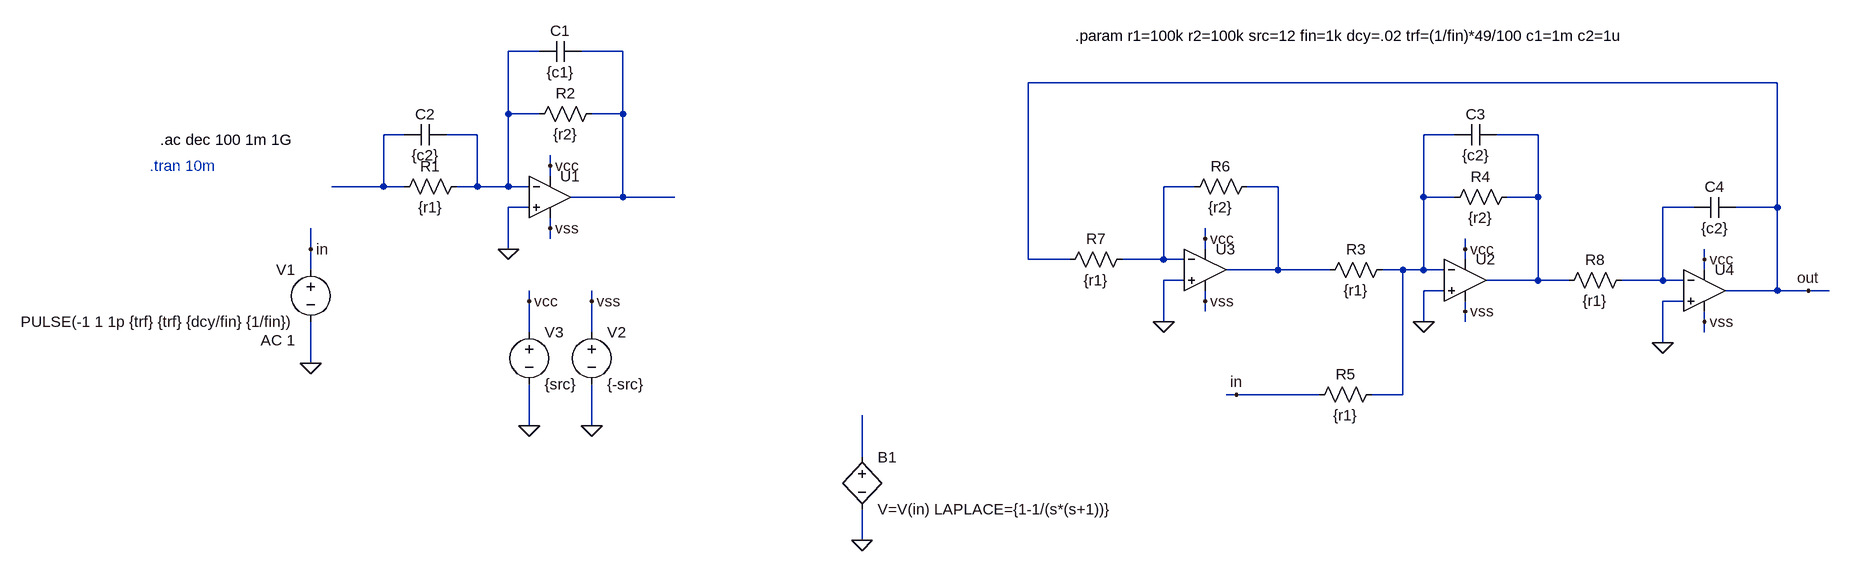
[diagram p0: schematic Draft1.asc]
Draft1.asc, the LTspice schematic file:
Version 4
SHEET 1 1684 680
WIRE -304 -496 -352 -496
WIRE -176 -496 -240 -496
WIRE 1600 -448 448 -448
WIRE -352 -400 -352 -496
WIRE -304 -400 -352 -400
WIRE -176 -400 -176 -496
WIRE -176 -400 -224 -400
WIRE -512 -368 -544 -368
WIRE -400 -368 -448 -368
WIRE 1104 -368 1056 -368
WIRE 1232 -368 1168 -368
WIRE -288 -320 -288 -336
WIRE -288 -304 -288 -320
WIRE -544 -288 -544 -368
WIRE -544 -288 -624 -288
WIRE -512 -288 -544 -288
WIRE -400 -288 -400 -368
WIRE -400 -288 -432 -288
WIRE -352 -288 -352 -400
WIRE -352 -288 -400 -288
WIRE -320 -288 -352 -288
WIRE 704 -288 656 -288
WIRE 832 -288 784 -288
WIRE -176 -272 -176 -400
WIRE -176 -272 -256 -272
WIRE -96 -272 -176 -272
WIRE 1056 -272 1056 -368
WIRE 1104 -272 1056 -272
WIRE 1232 -272 1232 -368
WIRE 1232 -272 1184 -272
WIRE -320 -256 -352 -256
WIRE 1472 -256 1424 -256
WIRE 1600 -256 1600 -448
WIRE 1600 -256 1536 -256
WIRE -288 -224 -288 -240
WIRE -288 -208 -288 -224
WIRE 720 -208 720 -224
WIRE -656 -192 -656 -224
WIRE -352 -192 -352 -256
WIRE 720 -192 720 -208
WIRE 1120 -192 1120 -208
WIRE 448 -176 448 -448
WIRE 512 -176 448 -176
WIRE 656 -176 656 -288
WIRE 656 -176 592 -176
WIRE 688 -176 656 -176
WIRE 1120 -176 1120 -192
WIRE 1488 -176 1488 -192
WIRE -656 -160 -656 -192
WIRE 832 -160 832 -288
WIRE 832 -160 752 -160
WIRE 912 -160 832 -160
WIRE 1024 -160 992 -160
WIRE 1056 -160 1056 -272
WIRE 1056 -160 1024 -160
WIRE 1088 -160 1056 -160
WIRE 1488 -160 1488 -176
WIRE 688 -144 656 -144
WIRE 1232 -144 1232 -272
WIRE 1232 -144 1152 -144
WIRE 1280 -144 1232 -144
WIRE 1424 -144 1424 -256
WIRE 1424 -144 1360 -144
WIRE 1456 -144 1424 -144
WIRE 1088 -128 1056 -128
WIRE 1600 -128 1600 -256
WIRE 1600 -128 1520 -128
WIRE 1648 -128 1600 -128
WIRE 1680 -128 1648 -128
WIRE -320 -112 -320 -128
WIRE -224 -112 -224 -128
WIRE 720 -112 720 -128
WIRE 1456 -112 1424 -112
WIRE 720 -96 720 -112
WIRE 1120 -96 1120 -112
WIRE 656 -80 656 -144
WIRE 1056 -80 1056 -128
WIRE 1120 -80 1120 -96
WIRE 1488 -80 1488 -96
WIRE -320 -64 -320 -112
WIRE -224 -64 -224 -112
WIRE 1488 -64 1488 -80
WIRE 1424 -48 1424 -112
WIRE -656 -16 -656 -80
WIRE 768 32 752 32
WIRE 896 32 768 32
WIRE 1024 32 1024 -160
WIRE 1024 32 976 32
WIRE -320 80 -320 16
WIRE -224 80 -224 16
WIRE 192 128 192 64
WIRE 192 256 192 208
FLAG -288 -320 vcc
FLAG -288 -224 vss
FLAG -656 -16 0
FLAG -224 80 0
FLAG -320 80 0
FLAG -320 -112 vcc
FLAG -224 -112 vss
FLAG -352 -192 0
FLAG -656 -192 in
FLAG 192 256 0
FLAG 1120 -192 vcc
FLAG 1120 -96 vss
FLAG 768 32 in
FLAG 720 -208 vcc
FLAG 720 -112 vss
FLAG 656 -80 0
FLAG 1488 -176 vcc
FLAG 1488 -80 vss
FLAG 1424 -48 0
FLAG 1648 -128 out
FLAG 1056 -80 0
SYMBOL OpAmps\\UniversalOpamp -288 -272 R0
SYMATTR InstName U1
SYMBOL res -416 -304 R90
WINDOW 0 0 56 VBottom 2
WINDOW 3 32 56 VTop 2
SYMATTR InstName R1
SYMATTR Value {r1}
SYMBOL res -208 -416 R90
WINDOW 0 0 56 VBottom 2
WINDOW 3 32 56 VTop 2
SYMATTR InstName R2
SYMATTR Value {r2}
SYMBOL voltage -656 -176 M0
WINDOW 123 24 124 Left 2
WINDOW 39 0 0 Left 0
SYMATTR Value2 AC 1
SYMATTR InstName V1
SYMATTR Value PULSE(-1 1 1p {trf} {trf} {dcy/fin} {1/fin})
SYMBOL voltage -224 -80 R0
WINDOW 123 0 0 Left 0
WINDOW 39 0 0 Left 0
SYMATTR InstName V2
SYMATTR Value {-src}
SYMBOL voltage -320 -80 R0
WINDOW 123 0 0 Left 0
WINDOW 39 0 0 Left 0
SYMATTR InstName V3
SYMATTR Value {src}
SYMBOL cap -240 -512 R90
WINDOW 0 0 32 VBottom 2
WINDOW 3 32 32 VTop 2
SYMATTR InstName C1
SYMATTR Value {c1}
SYMBOL cap -448 -384 R90
WINDOW 0 0 32 VBottom 2
WINDOW 3 32 32 VTop 2
SYMATTR InstName C2
SYMATTR Value {c2}
SYMBOL bv 192 112 R0
SYMATTR InstName B1
SYMATTR Value V=V(in) LAPLACE={1-1/(s*(s+1))}
SYMBOL cap 1168 -384 R90
WINDOW 0 0 32 VBottom 2
WINDOW 3 32 32 VTop 2
SYMATTR InstName C3
SYMATTR Value {c2}
SYMBOL OpAmps\\UniversalOpamp 1120 -144 R0
SYMATTR InstName U2
SYMBOL res 1008 -176 R90
WINDOW 0 0 56 VBottom 2
WINDOW 3 32 56 VTop 2
SYMATTR InstName R3
SYMATTR Value {r1}
SYMBOL res 1200 -288 R90
WINDOW 0 0 56 VBottom 2
WINDOW 3 32 56 VTop 2
SYMATTR InstName R4
SYMATTR Value {r2}
SYMBOL res 880 48 R270
WINDOW 0 32 56 VTop 2
WINDOW 3 0 56 VBottom 2
SYMATTR InstName R5
SYMATTR Value {r1}
SYMBOL OpAmps\\UniversalOpamp 720 -160 R0
SYMATTR InstName U3
SYMBOL res 800 -304 R90
WINDOW 0 0 56 VBottom 2
WINDOW 3 32 56 VTop 2
SYMATTR InstName R6
SYMATTR Value {r2}
SYMBOL res 608 -192 R90
WINDOW 0 0 56 VBottom 2
WINDOW 3 32 56 VTop 2
SYMATTR InstName R7
SYMATTR Value {r1}
SYMBOL OpAmps\\UniversalOpamp 1488 -128 R0
SYMATTR InstName U4
SYMBOL res 1376 -160 R90
WINDOW 0 0 56 VBottom 2
WINDOW 3 32 56 VTop 2
SYMATTR InstName R8
SYMATTR Value {r1}
SYMBOL cap 1536 -272 R90
WINDOW 0 0 32 VBottom 2
WINDOW 3 32 32 VTop 2
SYMATTR InstName C4
SYMATTR Value {c2}
TEXT -888 -360 Left 2 !.ac dec 100 1m 1G
TEXT 520 -520 Left 2 !.param r1=100k r2=100k src=12 fin=1k dcy=.02 trf=(1/fin)*49/100 c1=1m c2=1u
TEXT -904 -320 Left 2 ;.tran 10m

The netlist it stands for:
* Draft1.asc
XU1 0 N001 vcc vss N002 level1 Avol=1Meg GBW=10Meg Vos=0 En=0 Enk=0 In=0 Ink=0 Rin=500Meg  ; pins In+ In- V+ V- OUT
R1 N001 N003 {r1}
R2 N002 N001 {r2}
V1 in 0 PULSE(-1 1 1p {trf} {trf} {dcy/fin} {1/fin}) AC 1
V2 vss 0 {-src}
V3 vcc 0 {src}
C1 N002 N001 {c1}
C2 N001 N003 {c2}
B1 N009 0 V=V(in) LAPLACE={1-1/(s*(s+1))}
C3 N005 N004 {c2}
XU2 0 N004 vcc vss N005 level1 Avol=1Meg GBW=10Meg Vos=0 En=0 Enk=0 In=0 Ink=0 Rin=500Meg  ; pins In+ In- V+ V- OUT
R3 N004 N007 {r1}
R4 N005 N004 {r2}
R5 in N004 {r1}
XU3 0 N006 vcc vss N007 level1 Avol=1Meg GBW=10Meg Vos=0 En=0 Enk=0 In=0 Ink=0 Rin=500Meg  ; pins In+ In- V+ V- OUT
R6 N007 N006 {r2}
R7 N006 out {r1}
XU4 0 N008 vcc vss out level1 Avol=1Meg GBW=10Meg Vos=0 En=0 Enk=0 In=0 Ink=0 Rin=500Meg  ; pins In+ In- V+ V- OUT
R8 N008 N005 {r1}
C4 out N008 {c2}
.ac dec 100 1m 1G
.param r1=100k r2=100k src=12 fin=1k dcy=.02 trf=(1/fin)*49/100 c1=1m c2=1u
* .tran 10m
.lib UniversalOpAmp1.lib
.backanno
.end